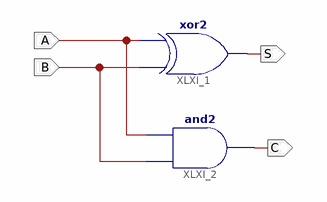
[diagram p0: schematic sheet 1]
// Xilinx ISE schematic HA.sch (artix7) as structural Verilog: 2 symbols, 4 ports
module HA (
  input  A,
  input  B,
  output S,
  output C
);

  and XLXI_2 (C, B, A);
  xor XLXI_1 (S, B, A);
endmodule
